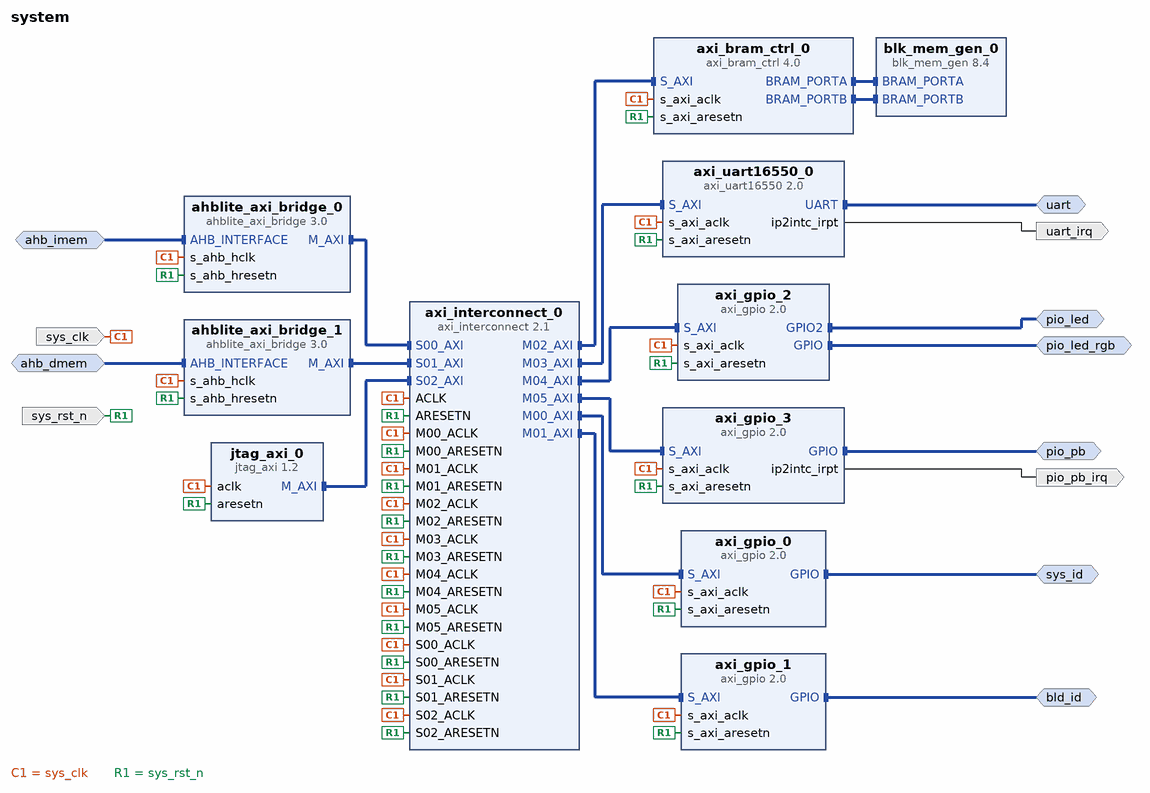
[diagram p0: block diagram of the top level]
# Vivado block design system, xc7a35ticsg324-1L, Vivado 2018.1_AR71169_AR71147
create_bd_design system

create_bd_intf_port -mode Slave -vlnv xilinx.com:interface:ahblite_rtl:2.0 ahb_imem
create_bd_intf_port -mode Master -vlnv xilinx.com:interface:uart_rtl:1.0 uart
create_bd_intf_port -mode Slave -vlnv xilinx.com:interface:ahblite_rtl:2.0 ahb_dmem
create_bd_intf_port -mode Master -vlnv xilinx.com:interface:gpio_rtl:1.0 sys_id
create_bd_intf_port -mode Master -vlnv xilinx.com:interface:gpio_rtl:1.0 pio_led_rgb
create_bd_intf_port -mode Master -vlnv xilinx.com:interface:gpio_rtl:1.0 pio_led
create_bd_intf_port -mode Master -vlnv xilinx.com:interface:gpio_rtl:1.0 pio_pb
create_bd_intf_port -mode Master -vlnv xilinx.com:interface:gpio_rtl:1.0 bld_id
create_bd_port -dir I -type clk sys_clk
set_property -dict {CONFIG.FREQ_HZ 25000000} [get_bd_ports sys_clk]
create_bd_port -dir I -type rst sys_rst_n
create_bd_port -dir O -type intr uart_irq
create_bd_port -dir O -type intr pio_pb_irq

create_bd_cell -type ip -vlnv xilinx.com:ip:ahblite_axi_bridge:3.0 ahblite_axi_bridge_0
set_property -dict {CONFIG.C_AHB_AXI_TIMEOUT 256} [get_bd_cells ahblite_axi_bridge_0]
create_bd_cell -type ip -vlnv xilinx.com:ip:ahblite_axi_bridge:3.0 ahblite_axi_bridge_1
set_property -dict {CONFIG.C_AHB_AXI_TIMEOUT 256 CONFIG.C_M_AXI_SUPPORTS_NARROW_BURST 1} [get_bd_cells ahblite_axi_bridge_1]
create_bd_cell -type ip -vlnv xilinx.com:ip:axi_bram_ctrl:4.0 axi_bram_ctrl_0
set_property -dict {CONFIG.PROTOCOL AXI4LITE CONFIG.SINGLE_PORT_BRAM 0 CONFIG.C_SELECT_XPM 0} [get_bd_cells axi_bram_ctrl_0]
create_bd_cell -type ip -vlnv xilinx.com:ip:axi_gpio:2.0 axi_gpio_0
set_property -dict {CONFIG.C_IS_DUAL 0 CONFIG.C_ALL_INPUTS 1} [get_bd_cells axi_gpio_0]
create_bd_cell -type ip -vlnv xilinx.com:ip:axi_gpio:2.0 axi_gpio_1
set_property -dict {CONFIG.C_ALL_INPUTS 1} [get_bd_cells axi_gpio_1]
create_bd_cell -type ip -vlnv xilinx.com:ip:axi_gpio:2.0 axi_gpio_2
set_property -dict [list \
  CONFIG.C_GPIO_WIDTH 12 \
  CONFIG.C_GPIO2_WIDTH 2 \
  CONFIG.C_IS_DUAL 1 \
  CONFIG.C_ALL_OUTPUTS 1 \
  CONFIG.C_ALL_OUTPUTS_2 1 \
] [get_bd_cells axi_gpio_2]
create_bd_cell -type ip -vlnv xilinx.com:ip:axi_gpio:2.0 axi_gpio_3
set_property -dict [list \
  CONFIG.C_GPIO_WIDTH 4 \
  CONFIG.C_ALL_INPUTS 1 \
  CONFIG.C_INTERRUPT_PRESENT 1 \
  CONFIG.GPIO_BOARD_INTERFACE Custom \
] [get_bd_cells axi_gpio_3]
create_bd_cell -type ip -vlnv xilinx.com:ip:axi_interconnect:2.1 axi_interconnect_0
set_property -dict [list \
  CONFIG.NUM_SI 3 \
  CONFIG.NUM_MI 6 \
  CONFIG.STRATEGY 1 \
  CONFIG.SYNCHRONIZATION_STAGES 2 \
] [get_bd_cells axi_interconnect_0]
create_bd_cell -type ip -vlnv xilinx.com:ip:axi_uart16550:2.0 axi_uart16550_0
set_property -dict {CONFIG.C_S_AXI_ACLK_FREQ_HZ 25000000} [get_bd_cells axi_uart16550_0]
create_bd_cell -type ip -vlnv xilinx.com:ip:blk_mem_gen:8.4 blk_mem_gen_0
set_property -dict [list \
  CONFIG.Memory_Type True_Dual_Port_RAM \
  CONFIG.Enable_B Use_ENB_Pin \
  CONFIG.Use_RSTB_Pin true \
  CONFIG.Port_B_Clock 100 \
  CONFIG.Port_B_Write_Rate 50 \
  CONFIG.Port_B_Enable_Rate 100 \
  CONFIG.EN_SAFETY_CKT false \
] [get_bd_cells blk_mem_gen_0]
create_bd_cell -type ip -vlnv xilinx.com:ip:jtag_axi:1.2 jtag_axi_0

# ---- connections ----

connect_bd_intf_net [get_bd_intf_pins ahblite_axi_bridge_0/M_AXI] [get_bd_intf_pins axi_interconnect_0/S00_AXI]
connect_bd_intf_net [get_bd_intf_pins blk_mem_gen_0/BRAM_PORTA] [get_bd_intf_pins axi_bram_ctrl_0/BRAM_PORTA]
connect_bd_intf_net [get_bd_intf_pins ahblite_axi_bridge_1/M_AXI] [get_bd_intf_pins axi_interconnect_0/S01_AXI]
connect_bd_intf_net [get_bd_intf_pins axi_interconnect_0/M00_AXI] [get_bd_intf_pins axi_gpio_0/S_AXI]
connect_bd_intf_net [get_bd_intf_pins jtag_axi_0/M_AXI] [get_bd_intf_pins axi_interconnect_0/S02_AXI]
connect_bd_intf_net [get_bd_intf_pins axi_bram_ctrl_0/BRAM_PORTB] [get_bd_intf_pins blk_mem_gen_0/BRAM_PORTB]
connect_bd_intf_net [get_bd_intf_pins axi_gpio_3/S_AXI] [get_bd_intf_pins axi_interconnect_0/M05_AXI]
connect_bd_intf_net [get_bd_intf_pins axi_gpio_2/S_AXI] [get_bd_intf_pins axi_interconnect_0/M04_AXI]
connect_bd_intf_net [get_bd_intf_pins axi_uart16550_0/S_AXI] [get_bd_intf_pins axi_interconnect_0/M03_AXI]
connect_bd_intf_net [get_bd_intf_pins axi_bram_ctrl_0/S_AXI] [get_bd_intf_pins axi_interconnect_0/M02_AXI]
connect_bd_intf_net [get_bd_intf_pins axi_gpio_1/S_AXI] [get_bd_intf_pins axi_interconnect_0/M01_AXI]
connect_bd_intf_net [get_bd_intf_ports ahb_imem] [get_bd_intf_pins ahblite_axi_bridge_0/AHB_INTERFACE]
connect_bd_intf_net [get_bd_intf_ports uart] [get_bd_intf_pins axi_uart16550_0/UART]
connect_bd_intf_net [get_bd_intf_ports ahb_dmem] [get_bd_intf_pins ahblite_axi_bridge_1/AHB_INTERFACE]
connect_bd_intf_net [get_bd_intf_ports sys_id] [get_bd_intf_pins axi_gpio_0/GPIO]
connect_bd_intf_net -intf_net axi_gpio_1_GPIO [get_bd_intf_ports pio_led_rgb] [get_bd_intf_pins axi_gpio_2/GPIO]
connect_bd_intf_net -intf_net axi_gpio_1_GPIO2 [get_bd_intf_ports pio_led] [get_bd_intf_pins axi_gpio_2/GPIO2]
connect_bd_intf_net -intf_net axi_gpio_2_GPIO [get_bd_intf_ports pio_pb] [get_bd_intf_pins axi_gpio_3/GPIO]
connect_bd_intf_net -intf_net axi_gpio_3_GPIO [get_bd_intf_ports bld_id] [get_bd_intf_pins axi_gpio_1/GPIO]
connect_bd_net [get_bd_ports sys_clk] \
  [get_bd_pins ahblite_axi_bridge_0/s_ahb_hclk] [get_bd_pins ahblite_axi_bridge_1/s_ahb_hclk] \
  [get_bd_pins axi_bram_ctrl_0/s_axi_aclk] [get_bd_pins axi_gpio_0/s_axi_aclk] [get_bd_pins axi_gpio_1/s_axi_aclk] \
  [get_bd_pins axi_gpio_2/s_axi_aclk] [get_bd_pins axi_gpio_3/s_axi_aclk] [get_bd_pins axi_uart16550_0/s_axi_aclk] \
  [get_bd_pins jtag_axi_0/aclk] [get_bd_pins axi_interconnect_0/ACLK] [get_bd_pins axi_interconnect_0/S00_ACLK] \
  [get_bd_pins axi_interconnect_0/M00_ACLK] [get_bd_pins axi_interconnect_0/M01_ACLK] \
  [get_bd_pins axi_interconnect_0/S01_ACLK] [get_bd_pins axi_interconnect_0/M02_ACLK] \
  [get_bd_pins axi_interconnect_0/S02_ACLK] [get_bd_pins axi_interconnect_0/M03_ACLK] \
  [get_bd_pins axi_interconnect_0/M04_ACLK] [get_bd_pins axi_interconnect_0/M05_ACLK]
connect_bd_net [get_bd_ports sys_rst_n] \
  [get_bd_pins ahblite_axi_bridge_0/s_ahb_hresetn] [get_bd_pins ahblite_axi_bridge_1/s_ahb_hresetn] \
  [get_bd_pins axi_bram_ctrl_0/s_axi_aresetn] [get_bd_pins axi_gpio_0/s_axi_aresetn] [get_bd_pins axi_gpio_1/s_axi_aresetn] \
  [get_bd_pins axi_gpio_2/s_axi_aresetn] [get_bd_pins axi_gpio_3/s_axi_aresetn] [get_bd_pins axi_uart16550_0/s_axi_aresetn] \
  [get_bd_pins jtag_axi_0/aresetn] [get_bd_pins axi_interconnect_0/ARESETN] [get_bd_pins axi_interconnect_0/S00_ARESETN] \
  [get_bd_pins axi_interconnect_0/M00_ARESETN] [get_bd_pins axi_interconnect_0/M01_ARESETN] \
  [get_bd_pins axi_interconnect_0/S01_ARESETN] [get_bd_pins axi_interconnect_0/M02_ARESETN] \
  [get_bd_pins axi_interconnect_0/S02_ARESETN] [get_bd_pins axi_interconnect_0/M03_ARESETN] \
  [get_bd_pins axi_interconnect_0/M04_ARESETN] [get_bd_pins axi_interconnect_0/M05_ARESETN]
connect_bd_net [get_bd_pins axi_uart16550_0/ip2intc_irpt] [get_bd_ports uart_irq]
connect_bd_net -net axi_gpio_2_ip2intc_irpt [get_bd_pins axi_gpio_3/ip2intc_irpt] [get_bd_ports pio_pb_irq]

# ---- address map ----
assign_bd_address -offset 0xFF000000 -range 4K -target_address_space [get_bd_addr_spaces ahb_dmem] [get_bd_addr_segs axi_gpio_0/S_AXI/Reg]
assign_bd_address -offset 0xFF001000 -range 4K -target_address_space [get_bd_addr_spaces ahb_dmem] [get_bd_addr_segs axi_gpio_1/S_AXI/Reg]
assign_bd_address -offset 0xFF010000 -range 4K -target_address_space [get_bd_addr_spaces ahb_dmem] [get_bd_addr_segs axi_uart16550_0/S_AXI/Reg]
assign_bd_address -offset 0xFF020000 -range 4K -target_address_space [get_bd_addr_spaces ahb_dmem] [get_bd_addr_segs axi_gpio_2/S_AXI/Reg]
assign_bd_address -offset 0xFF021000 -range 4K -target_address_space [get_bd_addr_spaces ahb_dmem] [get_bd_addr_segs axi_gpio_3/S_AXI/Reg]
assign_bd_address -offset 0xFFFF0000 -range 64K -target_address_space [get_bd_addr_spaces ahb_dmem] [get_bd_addr_segs axi_bram_ctrl_0/S_AXI/Mem0]
assign_bd_address -offset 0xFFFF0000 -range 64K -target_address_space [get_bd_addr_spaces ahb_imem] [get_bd_addr_segs axi_bram_ctrl_0/S_AXI/Mem0]
exclude_bd_addr_seg -offset 0xFF000000 -range 4K -target_address_space [get_bd_addr_spaces ahb_imem] [get_bd_addr_segs axi_gpio_0/S_AXI/Reg]
exclude_bd_addr_seg -offset 0xFF001000 -range 4K -target_address_space [get_bd_addr_spaces ahb_imem] [get_bd_addr_segs axi_gpio_1/S_AXI/Reg]
exclude_bd_addr_seg -offset 0xFF010000 -range 4K -target_address_space [get_bd_addr_spaces ahb_imem] [get_bd_addr_segs axi_uart16550_0/S_AXI/Reg]
exclude_bd_addr_seg -offset 0xFF020000 -range 4K -target_address_space [get_bd_addr_spaces ahb_imem] [get_bd_addr_segs axi_gpio_2/S_AXI/Reg]
exclude_bd_addr_seg -offset 0xFF021000 -range 4K -target_address_space [get_bd_addr_spaces ahb_imem] [get_bd_addr_segs axi_gpio_3/S_AXI/Reg]
assign_bd_address -offset 0xFF000000 -range 4K -target_address_space [get_bd_addr_spaces jtag_axi_0/Data] [get_bd_addr_segs axi_gpio_0/S_AXI/Reg]
assign_bd_address -offset 0xFF001000 -range 4K -target_address_space [get_bd_addr_spaces jtag_axi_0/Data] [get_bd_addr_segs axi_gpio_1/S_AXI/Reg]
assign_bd_address -offset 0xFF010000 -range 4K -target_address_space [get_bd_addr_spaces jtag_axi_0/Data] [get_bd_addr_segs axi_uart16550_0/S_AXI/Reg]
assign_bd_address -offset 0xFF020000 -range 4K -target_address_space [get_bd_addr_spaces jtag_axi_0/Data] [get_bd_addr_segs axi_gpio_2/S_AXI/Reg]
assign_bd_address -offset 0xFF021000 -range 4K -target_address_space [get_bd_addr_spaces jtag_axi_0/Data] [get_bd_addr_segs axi_gpio_3/S_AXI/Reg]
assign_bd_address -offset 0xFFFF0000 -range 64K -target_address_space [get_bd_addr_spaces jtag_axi_0/Data] [get_bd_addr_segs axi_bram_ctrl_0/S_AXI/Mem0]

validate_bd_design
save_bd_design
